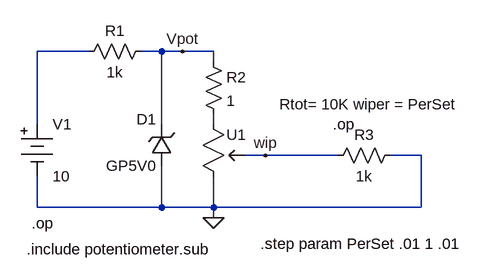
[diagram p0: schematic PotTest3.asc]
PotTest3.asc, the LTspice schematic file:
Version 4
SHEET 1 880 680
WIRE -192 -96 -272 -96
WIRE -80 -96 -112 -96
WIRE -48 -96 -80 -96
WIRE 0 -96 -48 -96
WIRE 0 -80 0 -96
WIRE -272 16 -272 -96
WIRE -80 16 -80 -96
WIRE 0 16 0 0
WIRE 80 64 48 64
WIRE 192 64 80 64
WIRE 320 64 272 64
WIRE -272 144 -272 96
WIRE -80 144 -80 80
WIRE -80 144 -272 144
WIRE 0 144 0 96
WIRE 0 144 -80 144
WIRE 320 144 320 64
WIRE 320 144 0 144
WIRE 0 160 0 144
FLAG 0 160 0
FLAG 80 64 wip
FLAG -48 -96 Vpot
SYMBOL Misc\\potentiometer -16 0 R0
WINDOW 3 117 -15 Left 0
SYMATTR Value Rtot= 10K wiper = PerSet
SYMATTR InstName U1
SYMBOL res -208 -80 R270
WINDOW 0 32 56 VTop 0
WINDOW 3 0 56 VBottom 0
SYMATTR InstName R1
SYMATTR Value 1k
SYMBOL Misc\\battery -272 0 R0
SYMATTR InstName V1
SYMATTR Value 10
SYMBOL zener -64 80 R180
WINDOW 0 24 72 Left 0
WINDOW 3 24 0 Left 0
SYMATTR InstName D1
SYMATTR Value GP5V0
SYMBOL res -16 -96 R0
SYMATTR InstName R2
SYMATTR Value 1
SYMBOL res 288 48 R90
WINDOW 0 0 56 VBottom 0
WINDOW 3 32 56 VTop 0
SYMATTR InstName R3
SYMATTR Value 1k
TEXT -288 208 Left 0 !.include potentiometer.sub
TEXT -280 168 Left 0 !.op
TEXT 72 200 Left 0 !.step param PerSet .01 1 .01
TEXT 184 16 Left 0 !.op

The netlist it stands for:
* PotTest3.asc
XU1 N002 0 wip potentiometer Rtot= 10K wiper = PerSet  ; pins A B C
R1 N001 Vpot 1k
V1 N001 0 10
D1 0 Vpot GP5V0
R2 Vpot N002 1
R3 0 wip 1k
.model D D
.lib standard.dio
.include potentiometer.sub
.op
.step param PerSet .01 1 .01
.op
.backanno
.end